# Altium schematic sheet SDVX_Mini.SchDoc: Pocket Voltex
size A4; DrawnBy: mon; Revision: 4; SheetNumber: 1; SheetTotal: 1
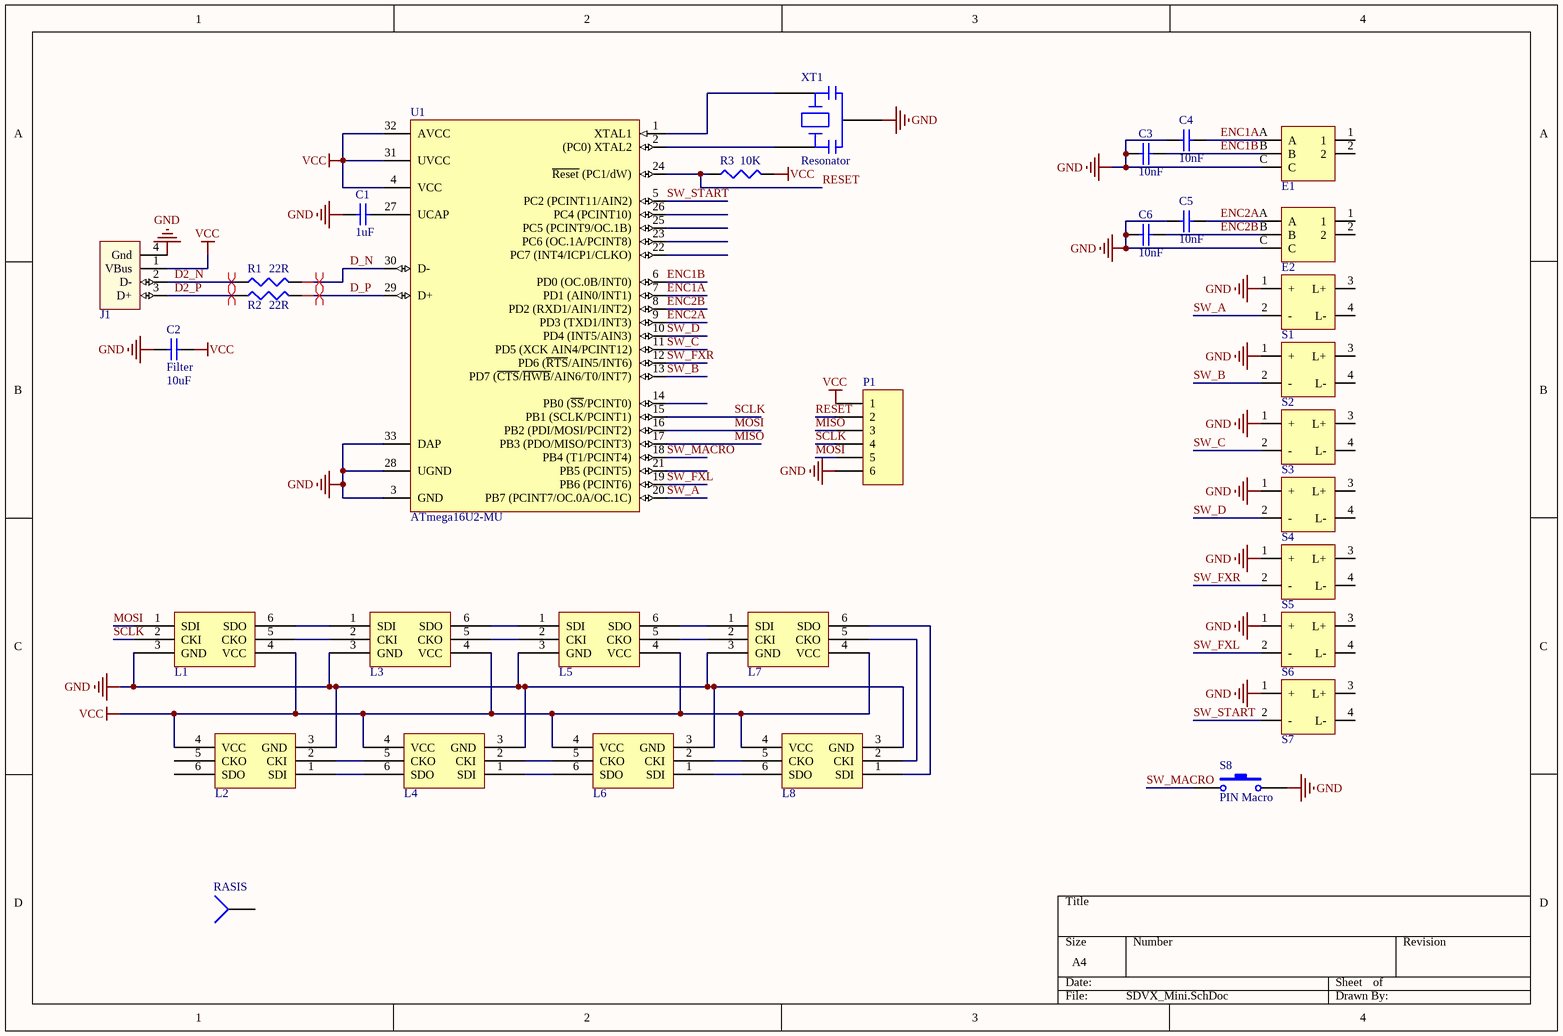
[diagram p0: SDVX_Mini.SchDoc]

## Parts
C1  value 1uF  [1608[0603]]  (hidden comment: Cap Semi)
C2  Filter  value 10uF  [1608[0603]]
C3  value 10nF  [1608[0603]]  (hidden comment: Cap Semi)
C4  value 10nF  [1608[0603]]  (hidden comment: Cap Semi)
C5  value 10nF  [1608[0603]]  (hidden comment: Cap Semi)
C6  value 10nF  [1608[0603]]  (hidden comment: Cap Semi)
E1  ENCODER_SWITCH  [ENCODER_NOSWITCH_BOURNS_PEC16-4]  (value not drawn)
E2  ENCODER_SWITCH  [ENCODER_NOSWITCH_BOURNS_PEC16-4]  (value not drawn)
J1  USB Connector  [MICRO-USB-SEEED]  (value not drawn)
L1  SK9822  [SK9822]  (value not drawn)
L2  SK9822  [SK9822]  (value not drawn)
L3  SK9822  [SK9822]  (value not drawn)
L4  SK9822  [SK9822]  (value not drawn)
L5  SK9822  [SK9822]  (value not drawn)
L6  SK9822  [SK9822]  (value not drawn)
L7  SK9822  [SK9822]  (value not drawn)
L8  SK9822  [SK9822]  (value not drawn)
P1  Header 6  [HDR1X6]  (value not drawn)
R1  value 22R  [J1-0603]
R2  value 22R  [J1-0603]  (hidden comment: Res3)
R3  value 10K  [J1-0603]
RASIS  Imp  [RASIS_INVERT]  (value not drawn)
S1  Cherry MX  [CHERRYMX_NO_LED]  (value not drawn)
S2  Cherry MX  [CHERRYMX_NO_LED]  (value not drawn)
S3  Cherry MX  [CHERRYMX_NO_LED]  (value not drawn)
S4  Cherry MX  [CHERRYMX_NO_LED]  (value not drawn)
S5  Cherry MX  [CHERRYMX_NO_LED]  (value not drawn)
S6  Cherry MX  [CHERRYMX_NO_LED]  (value not drawn)
S7  Cherry MX  [CHERRYMX_NO_LED]  (value not drawn)
S8  PIN Macro  [SWITCH_KSC421J]
U1  ATmega16U2-MU  [ATMEGA16U2-NOTHERMAL]
XT1  Resonator  [RESONATOR_CSTCE_V]

## Nets
GND: C1.2 C2.2 C3.1 C4.2 C5.2 C6.1 E1.C E2.C J1.4(Gnd) L1.3(GND) L2.3(GND) L3.3(GND) L4.3(GND) L5.3(GND) L6.3(GND) L7.3(GND) L8.3(GND) P1.6 S1.1(+) S2.1(+) S3.1(+) S4.1(+) S5.1(+) S6.1(+) S7.1(+) S8.2 U1.3(GND) U1.28(UGND) U1.33(DAP) XT1.2
VCC: C2.1 J1.1(VBus) L1.4(VCC) L2.4(VCC) L3.4(VCC) L4.4(VCC) L5.4(VCC) L6.4(VCC) L7.4(VCC) L8.4(VCC) P1.1 R3.2 U1.4(VCC) U1.31(UVCC) U1.32(AVCC)
D2_N: J1.2(D-) R1.1
D2_P: J1.3(D+) R2.1
D_N: R1.2 U1.30(D-)
D_P: R2.2 U1.29(D+)
ENC1A: C4.1 E1.A U1.7(PD1_(AIN0/INT1))
ENC1B: C3.2 E1.B U1.6(PD0_(OC.0B/INT0))
ENC2A: C5.1 E2.A U1.9(PD3_(TXD1/INT3))
ENC2B: C6.2 E2.B U1.8(PD2_(RXD1/AIN1/INT2))
MISO: P1.3 U1.17(PB3_(PDO/MISO/PCINT3))
MOSI: L1.1(SDI) P1.5 U1.16(PB2_(PDI/MOSI/PCINT2))
RESET: P1.2 R3.1 U1.24(~{Reset}_(PC1/dW))
SCLK: L1.2(CKI) P1.4 U1.15(PB1_(SCLK/PCINT1))
SW_A: S1.2(-) U1.20(PB7_(PCINT7/OC.0A/OC.1C))
SW_B: S2.2(-) U1.13(PD7_(~{CTS}/~{HWB}/AIN6/T0/INT7))
SW_C: S3.2(-) U1.11(PD5_(XCK_AIN4/PCINT12))
SW_D: S4.2(-) U1.10(PD4_(INT5/AIN3))
SW_FXL: S6.2(-) U1.19(PB6_(PCINT6))
SW_FXR: S5.2(-) U1.12(PD6_(~{RTS}/AIN5/INT6))
SW_MACRO: S8.1 U1.18(PB4_(T1/PCINT4))
SW_START: S7.2(-) U1.5(PC2_(PCINT11/AIN2))
NetC1_1: C1.1 U1.27(UCAP)
NetL1_5: L1.5(CKO) L3.2(CKI)
NetL1_6: L1.6(SDO) L3.1(SDI)
NetL2_1: L2.1(SDI) L4.6(SDO)
NetL2_2: L2.2(CKI) L4.5(CKO)
NetL3_5: L3.5(CKO) L5.2(CKI)
NetL3_6: L3.6(SDO) L5.1(SDI)
NetL4_1: L4.1(SDI) L6.6(SDO)
NetL4_2: L4.2(CKI) L6.5(CKO)
NetL5_5: L5.5(CKO) L7.2(CKI)
NetL5_6: L5.6(SDO) L7.1(SDI)
NetL6_1: L6.1(SDI) L8.6(SDO)
NetL6_2: L6.2(CKI) L8.5(CKO)
NetL7_5: L7.5(CKO) L8.2(CKI)
NetL7_6: L7.6(SDO) L8.1(SDI)
NetU1_1: U1.1(XTAL1) XT1.3
NetU1_2: U1.2((PC0)_XTAL2) XT1.1

Not connected (* = marked no-connect by the designer): E1 1 2; E2 1 2; L2 5(CKO) 6(SDO); RASIS 1; S1 3(L+) 4(L-); S2 3(L+) 4(L-); S3 3(L+) 4(L-); S4 3(L+) 4(L-); S5 3(L+) 4(L-); S6 3(L+) 4(L-); S7 3(L+) 4(L-); U1 14(PB0_(~{SS}/PCINT0)) 21(PB5_(PCINT5)) 22(PC7_(INT4/ICP1/CLKO)) 23(PC6_(OC.1A/PCINT8)) 25(PC5_(PCINT9/OC.1B)) 26(PC4_(PCINT10))

## Layout directives
differential pair: D2_N, D2_P, D_N, D_P

## Notes on the sheet
- Note the wrong port/pin assignments - part is wrong, datasheet correct.
  BGR instead of RGB due to ease of routing

## Library data of the parts
C1-C6 = Cap Semi: Capacitor (Semiconductor SIM Model); Published: 8-Jun-2000; LatestRevisionDate: 29-May-2009; LatestRevisionNote: IPC-7351 Footprint Added.; PackageReference: C1206; Publisher: Altium Limited; PackageDescription: Chip Capacitor
J1 = USB Connector: pin to pad: 4>5; Date Created: 08/09/2014
P1 = Header 6: Header, 6-Pin; LatestRevisionDate: 17-Jul-2002; LatestRevisionNote: Re-released for DXP Platform.; Publisher: Altium Limited
R1-R3 = Res3: Resistor; Published: 8-Jun-2000; LatestRevisionDate: 29-May-2009; LatestRevisionNote: IPC-7351 Footprint Added.; PackageReference: J1-0603; Publisher: Altium Limited; PackageDescription: Chip Resistor
RASIS = Socket: LatestRevisionDate: 17-Jul-2002; LatestRevisionNote: Re-released for DXP Platform.; Publisher: Altium Limited
S8 = SW-PB: Switch; Published: 24-Mar-1999; LatestRevisionDate: 17-Jul-2002; LatestRevisionNote: Re-released for DXP Platform.; PackageReference: SPST-2; Publisher: Altium Limited; PackageDescription: Switch; 2 Leads
U1 = ATmega16U2-MU: 8-bit AVR Microcontroller, 2.7-5.5V, 16KB Flash, 512 Bytes EEPROM, 512 Bytes SRAM, 32-pin VQFN, Industrial Grade (-40°C to 85°C); DatasheetVersion: revD, Nov-2010; PackageVersion: revA, Oct-2008; PackageReference: 32PG; PackageDescription: 32-Pin Quad Flat No-Lead (QFN) Sawn,  5 x 5 x 1.0 mm Body, Pitch 0.50 mm, 3.60mm Exposed Pad; Code_JEDEC: MO-220WHHD-2; ComponentLink1Description: Manufacturer URL; ComponentLink1URL: http://www.atmel.com/; ComponentLink2Description: ATmega8U2/16U2/32U2 Datasheet; ComponentLink2URL: http://www.atmel.com/dyn/resources/prod_documents/doc7799.pdf; ComponentLink3Description: ATmega8U2/16U2/32U2 Summary; ComponentLink3URL: http://www.atmel.com/dyn/resources/prod_documents/7799S.pdf